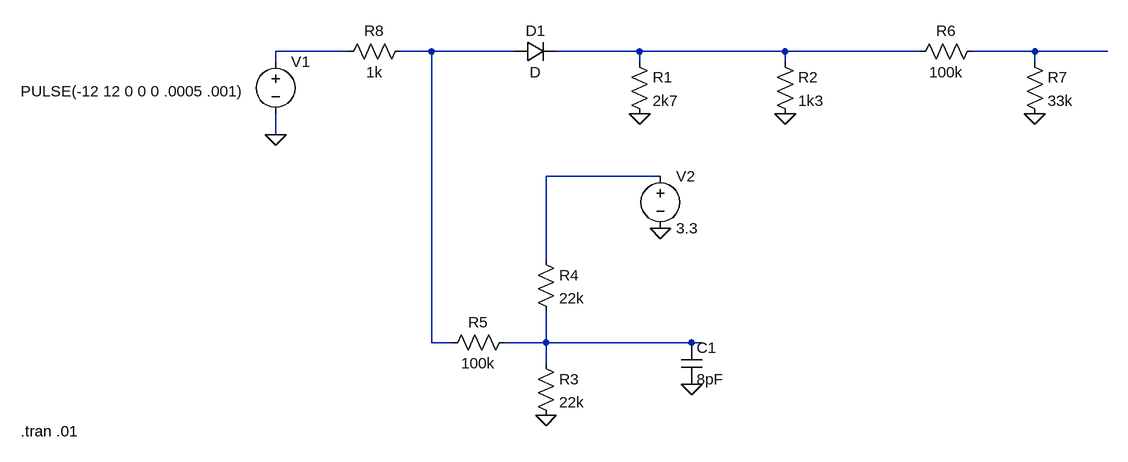
[diagram p0: schematic CP.asc]
CP.asc, the LTspice schematic file:
Version 4
SHEET 1 1364 712
WIRE 192 112 80 112
WIRE 320 112 272 112
WIRE 448 112 320 112
WIRE 640 112 512 112
WIRE 864 112 640 112
WIRE 1072 112 864 112
WIRE 1248 112 1152 112
WIRE 1360 112 1248 112
WIRE 80 128 80 112
WIRE 640 128 640 112
WIRE 864 128 864 112
WIRE 1248 128 1248 112
WIRE 80 240 80 208
WIRE 672 304 496 304
WIRE 496 432 496 304
WIRE 320 560 320 112
WIRE 352 560 320 560
WIRE 496 560 496 512
WIRE 496 560 432 560
WIRE 720 560 496 560
WIRE 736 560 720 560
WIRE 496 592 496 560
FLAG 80 240 0
FLAG 640 208 0
FLAG 864 208 0
FLAG 1248 208 0
FLAG 496 672 0
FLAG 672 384 0
FLAG 720 624 0
SYMBOL voltage 80 112 R0
WINDOW 3 -392 61 Left 2
WINDOW 123 0 0 Left 0
WINDOW 39 0 0 Left 0
SYMATTR Value PULSE(-12 12 0 0 0 .0005 .001)
SYMATTR InstName V1
SYMBOL res 624 112 R0
SYMATTR InstName R1
SYMATTR Value 2k7
SYMBOL res 848 112 R0
SYMATTR InstName R2
SYMATTR Value 1k3
SYMBOL res 480 576 R0
SYMATTR InstName R3
SYMATTR Value 22k
SYMBOL res 480 416 R0
SYMATTR InstName R4
SYMATTR Value 22k
SYMBOL res 448 544 R90
WINDOW 0 0 56 VBottom 2
WINDOW 3 32 56 VTop 2
SYMATTR InstName R5
SYMATTR Value 100k
SYMBOL res 1168 96 R90
WINDOW 0 0 56 VBottom 2
WINDOW 3 32 56 VTop 2
SYMATTR InstName R6
SYMATTR Value 100k
SYMBOL res 1232 112 R0
SYMATTR InstName R7
SYMATTR Value 33k
SYMBOL diode 448 128 R270
WINDOW 0 32 32 VTop 2
WINDOW 3 0 32 VBottom 2
SYMATTR InstName D1
SYMBOL voltage 672 288 R0
WINDOW 123 0 0 Left 0
WINDOW 39 0 0 Left 0
SYMATTR InstName V2
SYMATTR Value 3.3
SYMBOL res 288 96 R90
WINDOW 0 0 56 VBottom 2
WINDOW 3 32 56 VTop 2
SYMATTR InstName R8
SYMATTR Value 1k
SYMBOL cap 704 560 R0
SYMATTR InstName C1
SYMATTR Value 8pF
TEXT -312 696 Left 2 !.tran .01

The netlist it stands for:
* CP.asc
V1 N001 0 PULSE(-12 12 0 0 0 .0005 .001)
R1 N003 0 2k7
R2 N003 0 1k3
R3 N006 0 22k
R4 N005 N006 22k
R5 N006 N002 100k
R6 N004 N003 100k
R7 N004 0 33k
D1 N002 N003 D
V2 N005 0 3.3
R8 N002 N001 1k
C1 N006 0 8pF
.model D D
.lib standard.dio
.tran .01
.backanno
.end